# EasyEDA Pro project ProPrj_ESP32辉光钟_2025-08-24.epro, schematic IN12_x4

## Sheets
1 in12x4: Board Name: QS27_x4; Create Date: 2023-12-12; Page Name: in12x4; Project Name: QS27x4; Schematic Name: QS27_x4; Update Date: 2024-10-22; Add into BOM: yes; Company: Your Company; Convert to PCB: yes; Date: 2023-03-07; Draw By: mkonhy; REV: 1.0; Sheet: 1/1
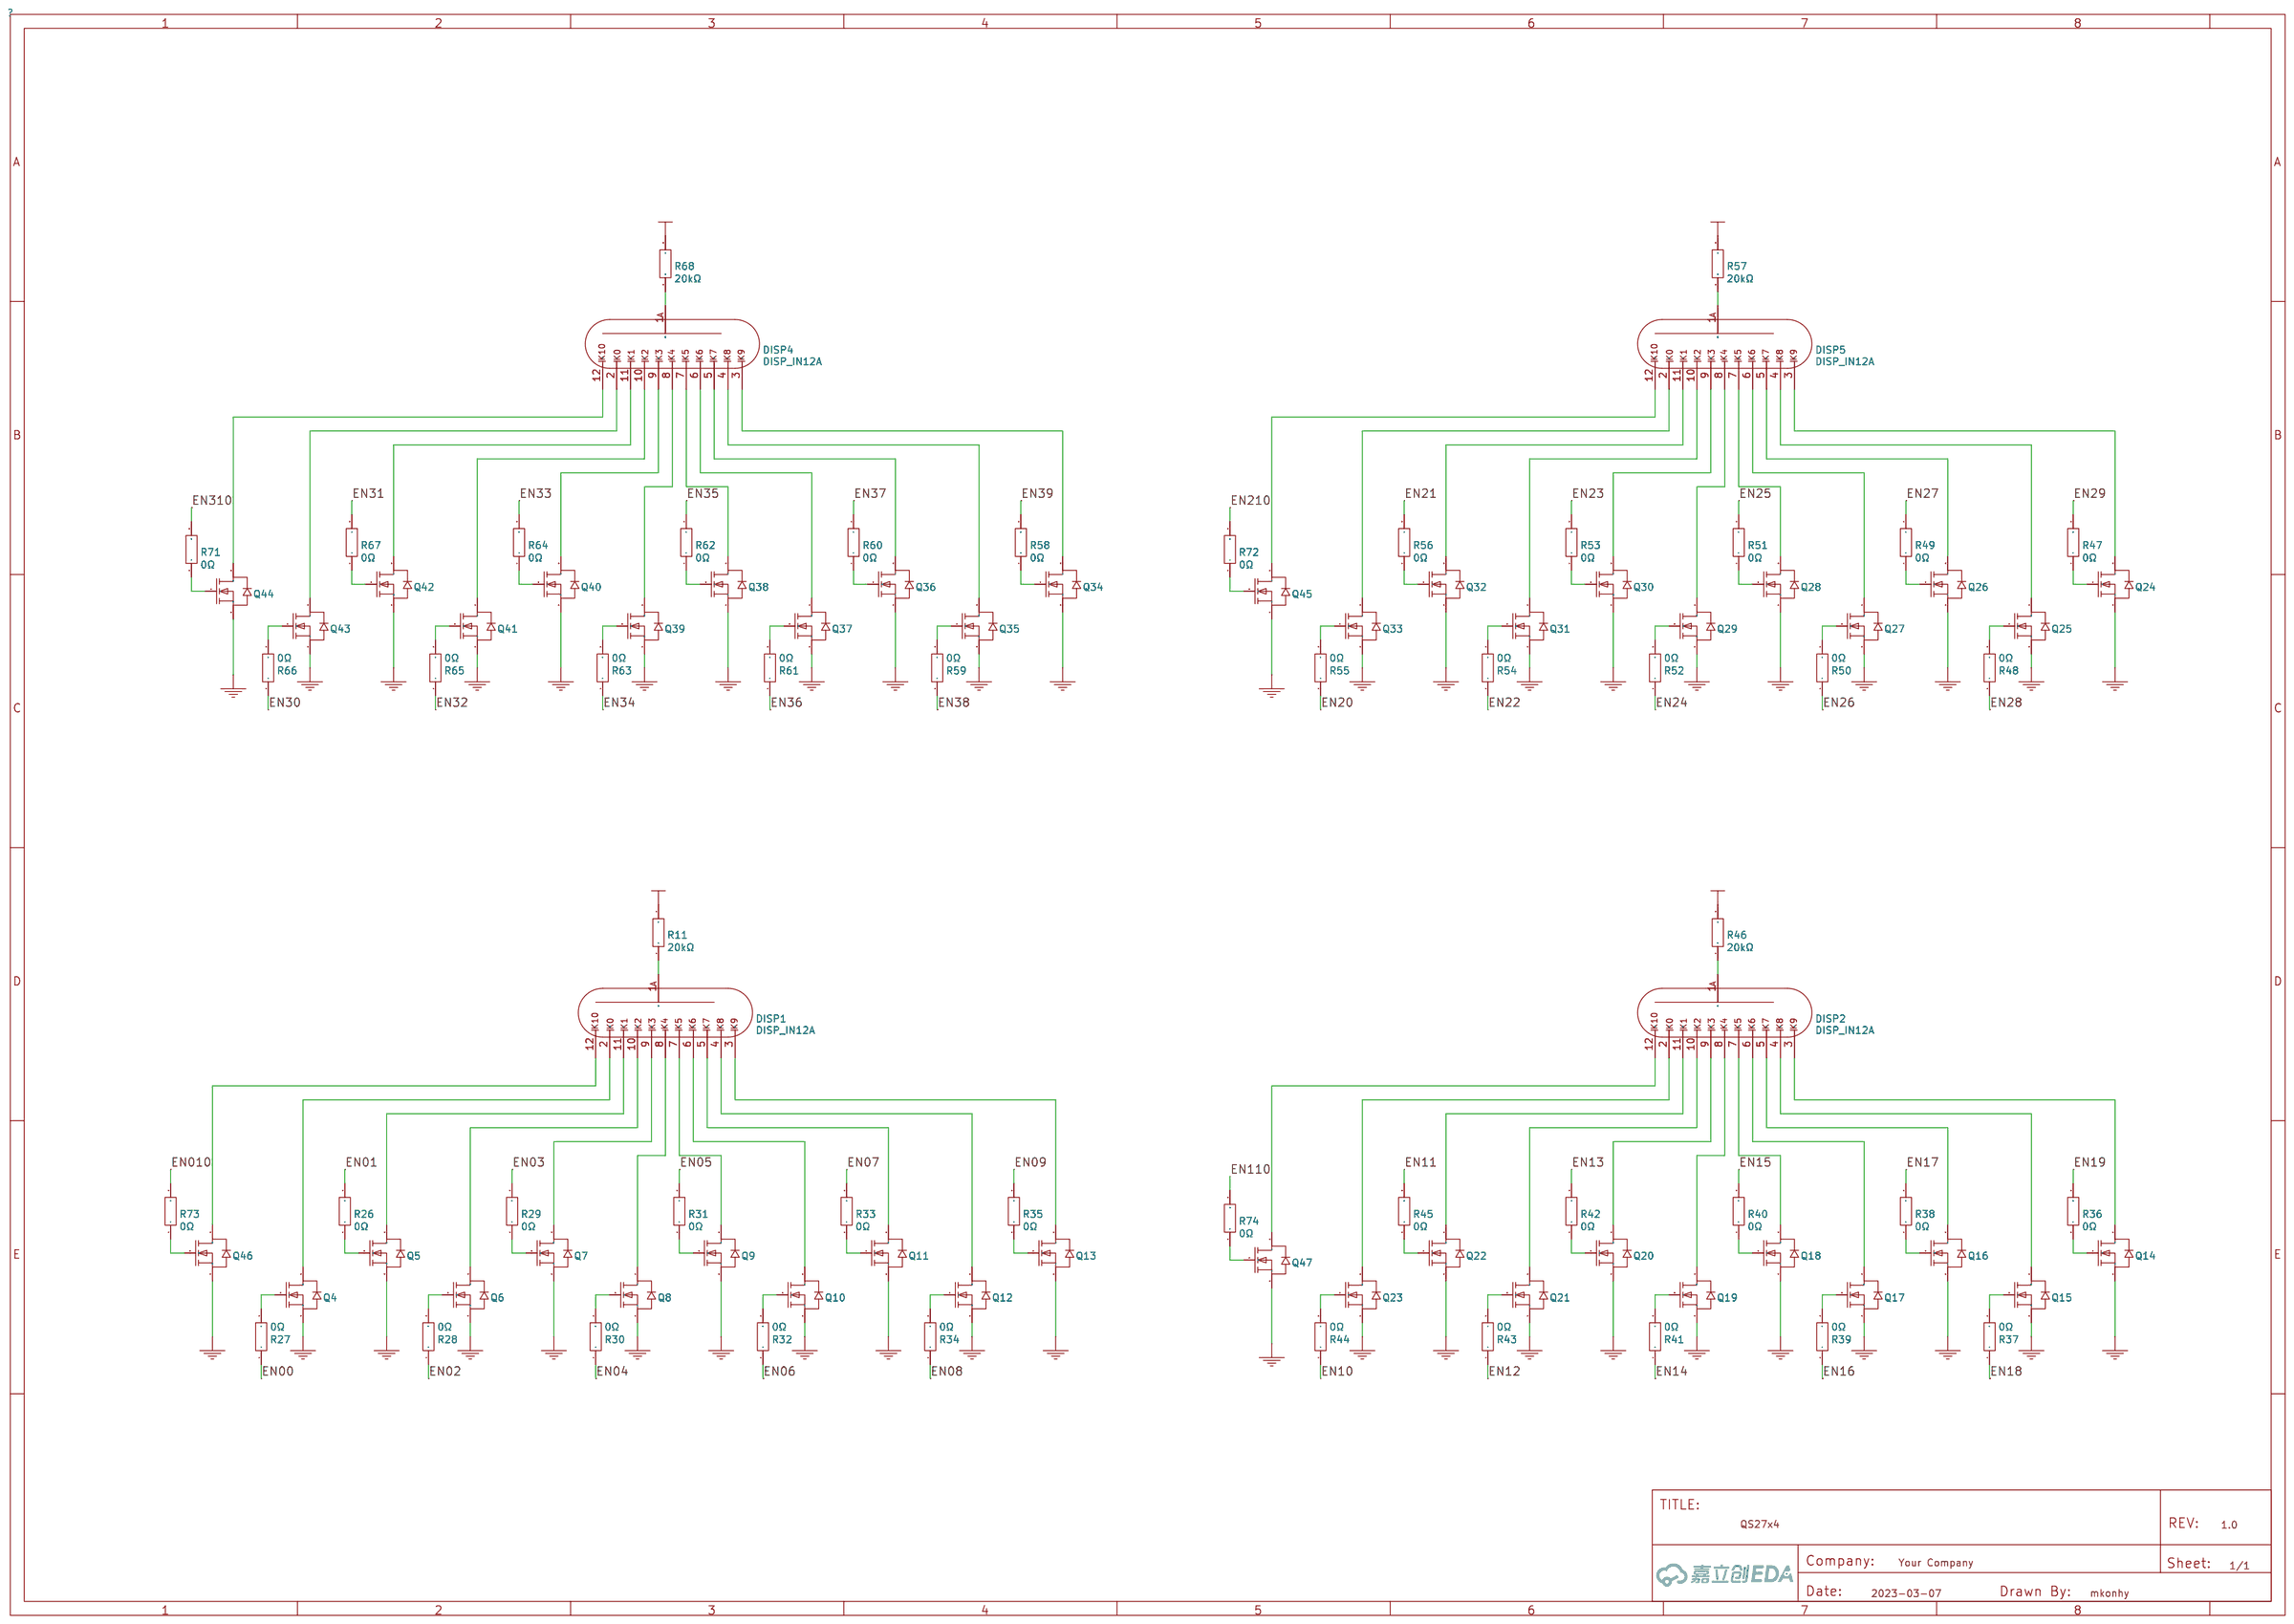
[diagram p0: in12x4]
2 move74HC595: Page Name: move74HC595
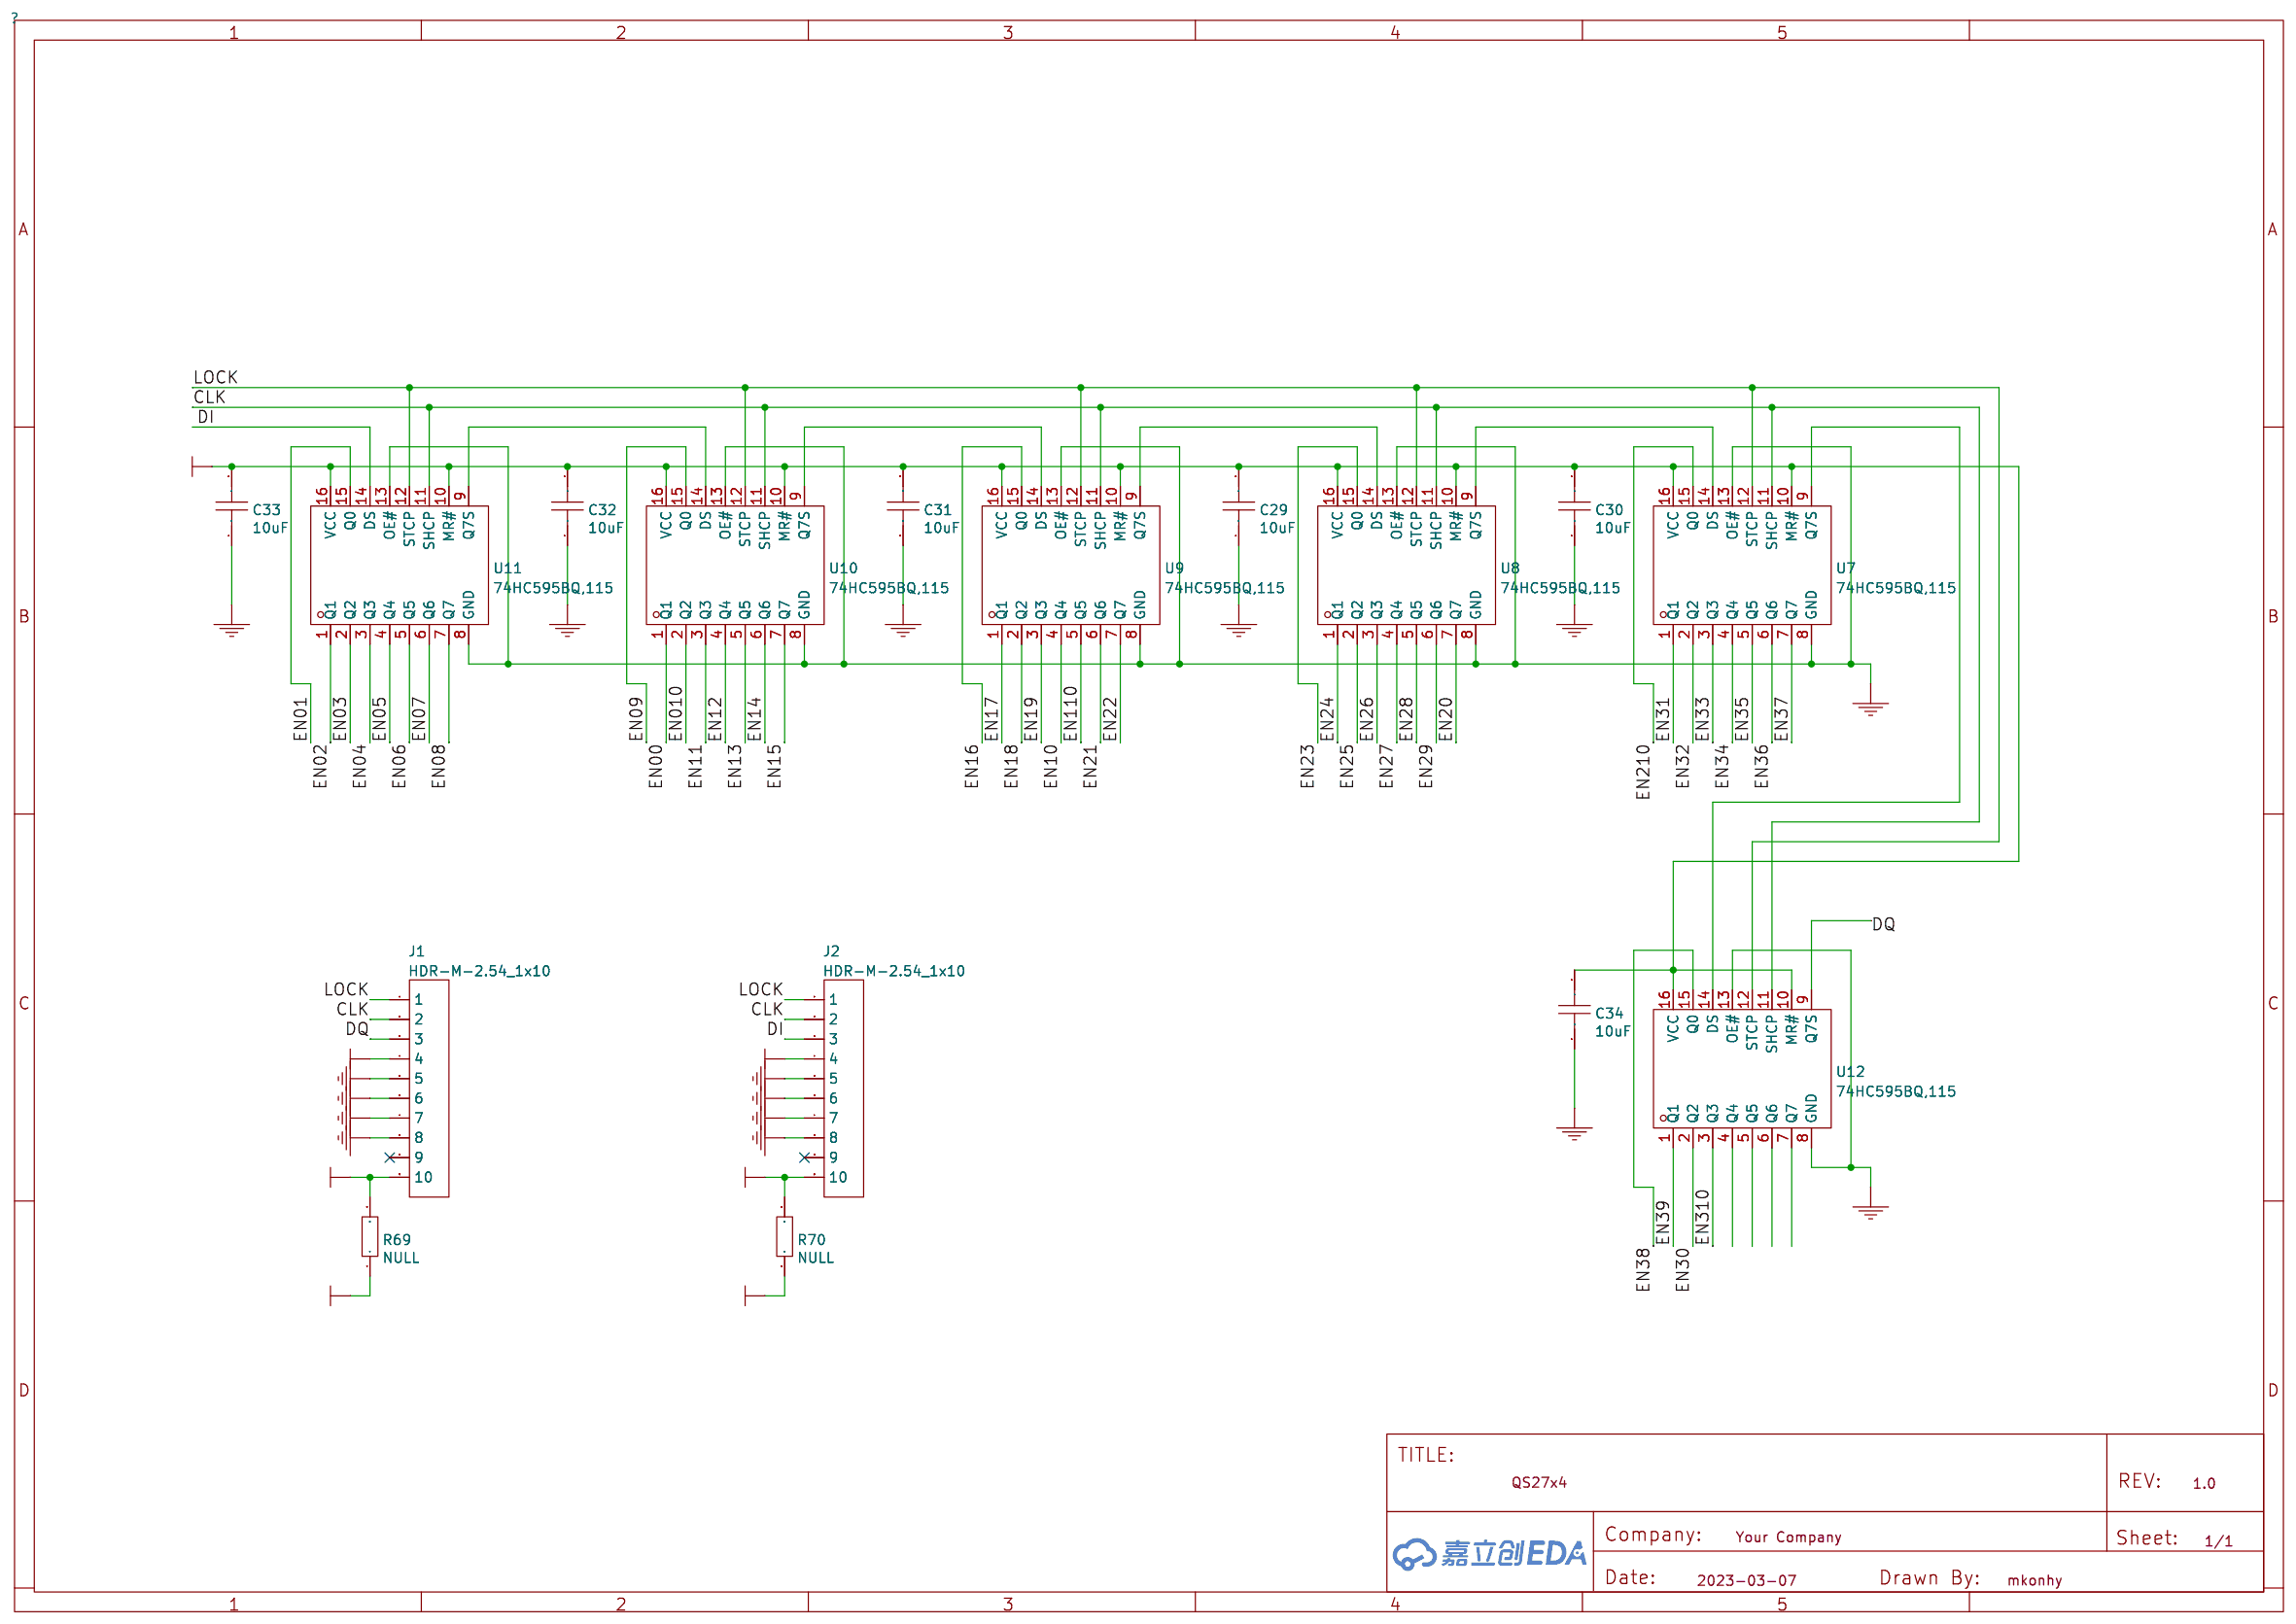
[diagram p1: move74HC595]

## Parts
sheet in12x4
DISP1  DISP_IN12A  [_IN12A]
DISP2  DISP_IN12A  [_IN12A]
DISP4  DISP_IN12A  [_IN12A]
DISP5  DISP_IN12A  [_IN12A]
Q4  DMN60H080DS-13  [SOT-23-3_L2.9-W1.3-P1.90-LS2.4-BR]
Q5  DMN60H080DS-13  [SOT-23-3_L2.9-W1.3-P1.90-LS2.4-BR]
Q6  DMN60H080DS-13  [SOT-23-3_L2.9-W1.3-P1.90-LS2.4-BR]
Q7  DMN60H080DS-13  [SOT-23-3_L2.9-W1.3-P1.90-LS2.4-BR]
Q8  DMN60H080DS-13  [SOT-23-3_L2.9-W1.3-P1.90-LS2.4-BR]
Q9  DMN60H080DS-13  [SOT-23-3_L2.9-W1.3-P1.90-LS2.4-BR]
Q10  DMN60H080DS-13  [SOT-23-3_L2.9-W1.3-P1.90-LS2.4-BR]
Q11  DMN60H080DS-13  [SOT-23-3_L2.9-W1.3-P1.90-LS2.4-BR]
Q12  DMN60H080DS-13  [SOT-23-3_L2.9-W1.3-P1.90-LS2.4-BR]
Q13  DMN60H080DS-13  [SOT-23-3_L2.9-W1.3-P1.90-LS2.4-BR]
Q14  DMN60H080DS-13  [SOT-23-3_L2.9-W1.3-P1.90-LS2.4-BR]
Q15  DMN60H080DS-13  [SOT-23-3_L2.9-W1.3-P1.90-LS2.4-BR]
Q16  DMN60H080DS-13  [SOT-23-3_L2.9-W1.3-P1.90-LS2.4-BR]
Q17  DMN60H080DS-13  [SOT-23-3_L2.9-W1.3-P1.90-LS2.4-BR]
Q18  DMN60H080DS-13  [SOT-23-3_L2.9-W1.3-P1.90-LS2.4-BR]
Q19  DMN60H080DS-13  [SOT-23-3_L2.9-W1.3-P1.90-LS2.4-BR]
Q20  DMN60H080DS-13  [SOT-23-3_L2.9-W1.3-P1.90-LS2.4-BR]
Q21  DMN60H080DS-13  [SOT-23-3_L2.9-W1.3-P1.90-LS2.4-BR]
Q22  DMN60H080DS-13  [SOT-23-3_L2.9-W1.3-P1.90-LS2.4-BR]
Q23  DMN60H080DS-13  [SOT-23-3_L2.9-W1.3-P1.90-LS2.4-BR]
Q24  DMN60H080DS-13  [SOT-23-3_L2.9-W1.3-P1.90-LS2.4-BR]
Q25  DMN60H080DS-13  [SOT-23-3_L2.9-W1.3-P1.90-LS2.4-BR]
Q26  DMN60H080DS-13  [SOT-23-3_L2.9-W1.3-P1.90-LS2.4-BR]
Q27  DMN60H080DS-13  [SOT-23-3_L2.9-W1.3-P1.90-LS2.4-BR]
Q28  DMN60H080DS-13  [SOT-23-3_L2.9-W1.3-P1.90-LS2.4-BR]
Q29  DMN60H080DS-13  [SOT-23-3_L2.9-W1.3-P1.90-LS2.4-BR]
Q30  DMN60H080DS-13  [SOT-23-3_L2.9-W1.3-P1.90-LS2.4-BR]
Q31  DMN60H080DS-13  [SOT-23-3_L2.9-W1.3-P1.90-LS2.4-BR]
Q32  DMN60H080DS-13  [SOT-23-3_L2.9-W1.3-P1.90-LS2.4-BR]
Q33  DMN60H080DS-13  [SOT-23-3_L2.9-W1.3-P1.90-LS2.4-BR]
Q34  DMN60H080DS-13  [SOT-23-3_L2.9-W1.3-P1.90-LS2.4-BR]
Q35  DMN60H080DS-13  [SOT-23-3_L2.9-W1.3-P1.90-LS2.4-BR]
Q36  DMN60H080DS-13  [SOT-23-3_L2.9-W1.3-P1.90-LS2.4-BR]
Q37  DMN60H080DS-13  [SOT-23-3_L2.9-W1.3-P1.90-LS2.4-BR]
Q38  DMN60H080DS-13  [SOT-23-3_L2.9-W1.3-P1.90-LS2.4-BR]
Q39  DMN60H080DS-13  [SOT-23-3_L2.9-W1.3-P1.90-LS2.4-BR]
Q40  DMN60H080DS-13  [SOT-23-3_L2.9-W1.3-P1.90-LS2.4-BR]
Q41  DMN60H080DS-13  [SOT-23-3_L2.9-W1.3-P1.90-LS2.4-BR]
Q42  DMN60H080DS-13  [SOT-23-3_L2.9-W1.3-P1.90-LS2.4-BR]
Q43  DMN60H080DS-13  [SOT-23-3_L2.9-W1.3-P1.90-LS2.4-BR]
Q44  DMN60H080DS-13  [SOT-23-3_L2.9-W1.3-P1.90-LS2.4-BR]
Q45  DMN60H080DS-13  [SOT-23-3_L2.9-W1.3-P1.90-LS2.4-BR]
Q46  DMN60H080DS-13  [SOT-23-3_L2.9-W1.3-P1.90-LS2.4-BR]
Q47  DMN60H080DS-13  [SOT-23-3_L2.9-W1.3-P1.90-LS2.4-BR]
R11  20kΩ  [R1206]
R26  0Ω  [R0402]
R27  0Ω  [R0402]
R28  0Ω  [R0402]
R29  0Ω  [R0402]
R30  0Ω  [R0402]
R31  0Ω  [R0402]
R32  0Ω  [R0402]
R33  0Ω  [R0402]
R34  0Ω  [R0402]
R35  0Ω  [R0402]
R36  0Ω  [R0402]
R37  0Ω  [R0402]
R38  0Ω  [R0402]
R39  0Ω  [R0402]
R40  0Ω  [R0402]
R41  0Ω  [R0402]
R42  0Ω  [R0402]
R43  0Ω  [R0402]
R44  0Ω  [R0402]
R45  0Ω  [R0402]
R46  20kΩ  [R1206]
R47  0Ω  [R0402]
R48  0Ω  [R0402]
R49  0Ω  [R0402]
R50  0Ω  [R0402]
R51  0Ω  [R0402]
R52  0Ω  [R0402]
R53  0Ω  [R0402]
R54  0Ω  [R0402]
R55  0Ω  [R0402]
R56  0Ω  [R0402]
R57  20kΩ  [R1206]
R58  0Ω  [R0402]
R59  0Ω  [R0402]
R60  0Ω  [R0402]
R61  0Ω  [R0402]
R62  0Ω  [R0402]
R63  0Ω  [R0402]
R64  0Ω  [R0402]
R65  0Ω  [R0402]
R66  0Ω  [R0402]
R67  0Ω  [R0402]
R68  20kΩ  [R1206]
R71  0Ω  [R0402]
R72  0Ω  [R0402]
R73  0Ω  [R0402]
R74  0Ω  [R0402]
sheet move74HC595
C29  10uF  [C0603]
C30  10uF  [C0603]
C31  10uF  [C0603]
C32  10uF  [C0603]
C33  10uF  [C0603]
C34  10uF  [C0603]
J1  HDR-M-2.54_1x10  [HDR-M-2.54_1X10]
J2  HDR-M-2.54_1x10  [HDR-M-2.54_1X10]
R69  NULL  [R1206]
R70  NULL  [R1206]
U7  74HC595BQ,115  [DHVQFN-16_L3.5-W2.5-P0.50-BL-EP]
U8  74HC595BQ,115  [DHVQFN-16_L3.5-W2.5-P0.50-BL-EP]
U9  74HC595BQ,115  [DHVQFN-16_L3.5-W2.5-P0.50-BL-EP]
U10  74HC595BQ,115  [DHVQFN-16_L3.5-W2.5-P0.50-BL-EP]
U11  74HC595BQ,115  [DHVQFN-16_L3.5-W2.5-P0.50-BL-EP]
U12  74HC595BQ,115  [DHVQFN-16_L3.5-W2.5-P0.50-BL-EP]

## Library data of the parts
DISP1 DISP2 DISP4 DISP5 = DISP_IN12A
Q4-Q47 = DMN60H080DS-13: 类型:1个N沟道;漏源电压(Vdss):600V;连续漏极电流(Id):80mA;功率(Pd):1.1W;导通电阻(RDS(on)@Vgs,Id):100Ω@60mA,10V;阈值电压(Vgs(th)@Id):3V@250uA;; LCSC Part Name: 1个N沟道 耐压:600V 电流:80mA; Supplier Part: C6934856; Manufacturer: DIODES(美台); Supplier Footprint: SOT-23-3; JLCPCB Part Class: Extended Part; Datasheet: https://atta.szlcsc.com/upload/public/pdf/source/20230810/F895B096F5947446D4429E65FE194FF6.pdf; Supplier: LCSC; Type: 1个N沟道; Drain Source Voltage (Vdss): 600V; Continuous Drain Current (Id): 80mA; Power Dissipation (Pd): 1.1W; Drain Source On Resistance (RDS(on)@Vgs,Id): 100Ω@60mA,10V; Gate Threshold Voltage (Vgs(th)@Id): 3V@250uA; Total Gate Charge (Qg@Vgs): 1.7nC@10V; Input Capacitance (Ciss@Vds): 25pF@25V; Operating Temperature: -55℃~+150℃@(Tj)
R11 R46 R57 R68-R70 = 20kΩ: Supplier: LCSC; Manufacturer: UNI-ROYAL(厚声); Manufacturer Part: 1206W4F2002T5E; Supplier Part: C18003; Resistance: 20K; JLCPCB Part Class: Extended Part
R26-R45 R47-R56 R58-R67 R71-R74 = 0Ω: Supplier: LCSC; Supplier Part: C352379; Manufacturer: RESI(开步睿思）; Manufacturer Part: AECR0402F9R10T9; Resistance: 9.1; JLCPCB Part Class: Extended Part
C29-C34 = 10uF: Supplier: LCSC; Manufacturer: SAMSUNG(三星); Manufacturer Part: CL10A106MA8NRNC; Supplier Part: C96446; JLCPCB Part Class: Basic Part
J1 J2 = HDR-M-2.54_1x10: Supplier Part: C57369; Supplier: LCSC
U7-U12 = 74HC595BQ,115: 功能:-;; Supplier Part: C730243; Manufacturer: Nexperia(安世); Supplier Footprint: DHVQFN-16-EP(2.5x3.5); JLCPCB Part Class: Extended Part; Datasheet: https://atta.szlcsc.com/upload/public/pdf/source/20240724/C3A3241CA190230F407C83CEC4244600.pdf; Supplier: LCSC

## Nets
PGND: C29.1 C30.1 C31.1 C32.1 C33.1 C34.1 J1.5 J1.6 J1.7 J1.8 J2.5 J2.6 J2.7 J2.8 Q4.2(S) Q5.2(S) Q6.2(S) Q7.2(S) Q8.2(S) Q9.2(S) Q10.2(S) Q11.2(S) Q12.2(S) Q13.2(S) Q14.2(S) Q15.2(S) Q16.2(S) Q17.2(S) Q18.2(S) Q19.2(S) Q20.2(S) Q21.2(S) Q22.2(S) Q23.2(S) Q24.2(S) Q25.2(S) Q26.2(S) Q27.2(S) Q28.2(S) Q29.2(S) Q30.2(S) Q31.2(S) Q32.2(S) Q33.2(S) Q34.2(S) Q35.2(S) Q36.2(S) Q37.2(S) Q38.2(S) Q39.2(S) Q40.2(S) Q41.2(S) Q42.2(S) Q43.2(S) Q44.2(S) Q45.2(S) Q46.2(S) Q47.2(S) U7.8(GND) U7.13(OE#) U8.8(GND) U8.13(OE#) U9.8(GND) U9.13(OE#) U10.8(GND) U10.13(OE#) U11.8(GND) U11.13(OE#) U12.8(GND) U12.13(OE#)
VCC+3V3: C29.2 C30.2 C31.2 C32.2 C33.2 C34.2 J1.4 J2.4 U7.10(MR#) U7.16(VCC) U8.10(MR#) U8.16(VCC) U9.10(MR#) U9.16(VCC) U10.10(MR#) U10.16(VCC) U11.10(MR#) U11.16(VCC) U12.10(MR#) U12.16(VCC)
VCC+180V: R11.2 R46.2 R57.2 R68.2 R69.1 R70.1
VCC+180V_EXT1: J1.10 R69.2
VCC+180V_EXT2: J2.10 R70.2
CLK: J1.2 J2.2 U7.11(SHCP) U8.11(SHCP) U9.11(SHCP) U10.11(SHCP) U11.11(SHCP) U12.11(SHCP)
DI: J2.3 U11.14(DS)
DQ: J1.3 U12.9(Q7S)
EN00: R27.1 U10.1(Q1)
EN01: R26.2 U11.15(Q0)
EN02: R28.1 U11.1(Q1)
EN03: R29.2 U11.2(Q2)
EN04: R30.1 U11.3(Q3)
EN05: R31.2 U11.4(Q4)
EN06: R32.1 U11.5(Q5)
EN07: R33.2 U11.6(Q6)
EN08: R34.1 U11.7(Q7)
EN09: R35.2 U10.15(Q0)
EN10: R44.1 U9.4(Q4)
EN010: R73.2 U10.2(Q2)
EN11: R45.2 U10.3(Q3)
EN12: R43.1 U10.4(Q4)
EN13: R42.2 U10.5(Q5)
EN14: R41.1 U10.6(Q6)
EN15: R40.2 U10.7(Q7)
EN16: R39.1 U9.15(Q0)
EN17: R38.2 U9.1(Q1)
EN18: R37.1 U9.2(Q2)
EN19: R36.2 U9.3(Q3)
EN20: R55.1 U8.7(Q7)
EN21: R56.2 U9.6(Q6)
EN22: R54.1 U9.7(Q7)
EN23: R53.2 U8.15(Q0)
EN24: R52.1 U8.1(Q1)
EN25: R51.2 U8.2(Q2)
EN26: R50.1 U8.3(Q3)
EN27: R49.2 U8.4(Q4)
EN28: R48.1 U8.5(Q5)
EN29: R47.2 U8.6(Q6)
EN30: R66.1 U12.2(Q2)
EN31: R67.2 U7.1(Q1)
EN32: R65.1 U7.2(Q2)
EN33: R64.2 U7.3(Q3)
EN34: R63.1 U7.4(Q4)
EN35: R62.2 U7.5(Q5)
EN36: R61.1 U7.6(Q6)
EN37: R60.2 U7.7(Q7)
EN38: R59.1 U12.15(Q0)
EN39: R58.2 U12.1(Q1)
EN110: R74.2 U9.5(Q5)
EN210: R72.2 U7.15(Q0)
EN310: R71.2 U12.3(Q3)
LOCK: J1.1 J2.1 U7.12(STCP) U8.12(STCP) U9.12(STCP) U10.12(STCP) U11.12(STCP) U12.12(STCP)
$1N13: DISP1.1(ANODE) R11.1
$1N14: DISP1.2(K0) Q4.3(D)
$1N15: DISP1.11(K1) Q5.3(D)
$1N16: DISP1.10(K2) Q6.3(D)
$1N17: DISP1.9(K3) Q7.3(D)
$1N18: DISP1.8(K4) Q8.3(D)
$1N19: DISP1.7(K5) Q9.3(D)
$1N20: DISP1.6(K6) Q10.3(D)
$1N21: DISP1.5(K7) Q11.3(D)
$1N22: DISP1.4(K8) Q12.3(D)
$1N23: DISP1.3(K9) Q13.3(D)
$1N90: Q4.1(G) R27.2
$1N91: Q5.1(G) R26.1
$1N92: Q6.1(G) R28.2
$1N93: Q7.1(G) R29.1
$1N94: Q8.1(G) R30.2
$1N95: Q9.1(G) R31.1
$1N96: Q10.1(G) R32.2
$1N97: Q11.1(G) R33.1
$1N98: Q12.1(G) R34.2
$1N99: Q13.1(G) R35.1
$1N100: Q14.1(G) R36.1
$1N101: Q15.1(G) R37.2
$1N102: Q16.1(G) R38.1
$1N103: Q17.1(G) R39.2
$1N104: Q18.1(G) R40.1
$1N105: Q19.1(G) R41.2
$1N106: Q20.1(G) R42.1
$1N107: Q21.1(G) R43.2
$1N108: Q22.1(G) R45.1
$1N109: Q23.1(G) R44.2
$1N176: DISP2.3(K9) Q14.3(D)
$1N177: DISP2.4(K8) Q15.3(D)
$1N178: DISP2.5(K7) Q16.3(D)
$1N179: DISP2.6(K6) Q17.3(D)
$1N180: DISP2.7(K5) Q18.3(D)
$1N181: DISP2.8(K4) Q19.3(D)
$1N182: DISP2.9(K3) Q20.3(D)
$1N183: DISP2.10(K2) Q21.3(D)
$1N184: DISP2.11(K1) Q22.3(D)
$1N185: DISP2.2(K0) Q23.3(D)
$1N186: DISP2.1(ANODE) R46.1
$1N187: Q24.1(G) R47.1
$1N188: Q25.1(G) R48.2
$1N189: Q26.1(G) R49.1
$1N190: Q27.1(G) R50.2
$1N191: Q28.1(G) R51.1
$1N192: Q29.1(G) R52.2
$1N193: Q30.1(G) R53.1
$1N194: Q31.1(G) R54.2
$1N195: Q32.1(G) R56.1
$1N196: Q33.1(G) R55.2
$1N265: DISP5.3(K9) Q24.3(D)
$1N266: DISP5.4(K8) Q25.3(D)
$1N267: DISP5.5(K7) Q26.3(D)
$1N268: DISP5.6(K6) Q27.3(D)
$1N269: DISP5.7(K5) Q28.3(D)
$1N270: DISP5.8(K4) Q29.3(D)
$1N271: DISP5.9(K3) Q30.3(D)
$1N272: DISP5.10(K2) Q31.3(D)
$1N273: DISP5.11(K1) Q32.3(D)
$1N274: DISP5.2(K0) Q33.3(D)
$1N275: DISP5.1(ANODE) R57.1
$1N276: Q34.1(G) R58.1
$1N277: Q35.1(G) R59.2
$1N278: Q36.1(G) R60.1
$1N279: Q37.1(G) R61.2
$1N280: Q38.1(G) R62.1
$1N281: Q39.1(G) R63.2
$1N282: Q40.1(G) R64.1
$1N283: Q41.1(G) R65.2
$1N284: Q42.1(G) R67.1
$1N285: Q43.1(G) R66.2
$1N354: DISP4.3(K9) Q34.3(D)
$1N355: DISP4.5(K7) Q36.3(D)
$1N356: DISP4.7(K5) Q38.3(D)
$1N357: DISP4.9(K3) Q40.3(D)
$1N358: DISP4.11(K1) Q42.3(D)
$1N359: DISP4.2(K0) Q43.3(D)
$1N360: DISP4.1(ANODE) R68.1
$1N361: DISP4.10(K2) Q41.3(D)
$1N362: DISP4.8(K4) Q39.3(D)
$1N363: DISP4.6(K6) Q37.3(D)
$1N364: DISP4.4(K8) Q35.3(D)
$1N29463: Q44.1(G) R71.1
$1N29470: DISP4.12(K10) Q44.3(D)
$1N29555: Q45.1(G) R72.1
$1N29562: DISP5.12(K10) Q45.3(D)
$1N29644: Q46.1(G) R73.1
$1N29654: DISP1.12(K10) Q46.3(D)
$1N29736: Q47.1(G) R74.1
$1N29746: DISP2.12(K10) Q47.3(D)
$2N21: U10.14(DS) U11.9(Q7S)
$2N22: U9.14(DS) U10.9(Q7S)
$2N23: U8.14(DS) U9.9(Q7S)
$2N24: U7.14(DS) U8.9(Q7S)
$2N2665: U7.9(Q7S) U12.14(DS)

Not connected (* = marked no-connect by the designer): J1 9*; J2 9*; U12 4(Q4) 5(Q5) 6(Q6) 7(Q7)
